# Altium schematic sheet Flash - M25P32-VMW6TG.SchDoc
size A4; minSupply: 2V4; maxSupply: 3V7
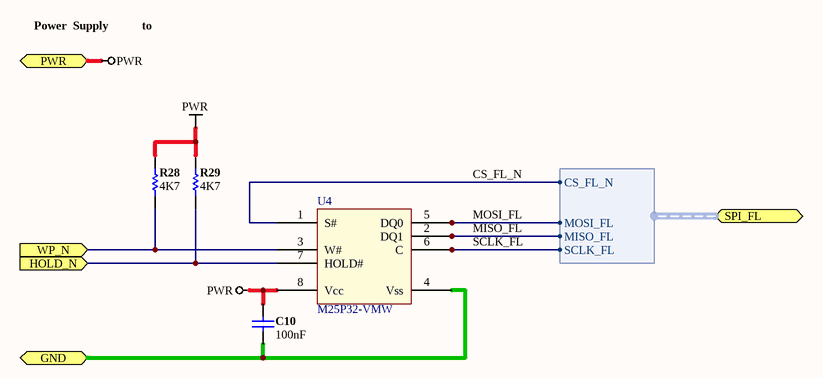
[diagram p0: Flash - M25P32-VMW6TG.SchDoc]

## Parts
C10  value 100nF  [CAPC0402(1005)60_L]  (hidden comment: CAP 100nF 16V 0402(1005))
R28  4K7  [RESC0402(1005)40_L]
R29  4K7  [RESC0402(1005)40_L]
U4  M25P32-VMW  [SOIC-8W]

## Ports
GND, HOLD_N (in), PWR, SPI_FL (harness SPI_FLASH), WP_N (in)

## Harnesses
SPI_FLASH: MOSI_FL, MISO_FL, SCLK_FL, CS_FL_N

## Nets
PWR: C10.1 R28.2 R29.2 U4.8(Vcc) ; port PWR
CS_FL_N: U4.1(S#) ; port SPI_FL.CS_FL_N
GND: C10.2 U4.4(Vss) ; port GND
HOLD_N: R29.1 U4.7(HOLD#) ; port HOLD_N
MISO_FL: U4.2(DQ1) ; port SPI_FL.MISO_FL
MOSI_FL: U4.5(DQ0) ; port SPI_FL.MOSI_FL
SCLK_FL: U4.6(C) ; port SPI_FL.SCLK_FL
WP_N: R28.1 U4.3(W#) ; port WP_N

## Notes on the sheet
- Power  Supply
- to

## Library data of the parts
C10 = CAP 100nF 16V ±10% 0402 (1005 Metric) Thickness 0.6mm SMD: Manufacturer_PN: C0402C104K8PACTU; Case-EIA: 0402; Case-Metric: 1005; Tolerance: ±10%; Max Thickness: 0.6 mm; Rated Voltage: 16 V; Technology: SMT; Manufacturer Part Number: C0402C104K8PACTU
R28 R29 = 0402 (1005 Metric) 1/16 W 4K7 1 Thick Film Chip Resistor: Manufacturer_PN: CR0402-FX-4701GLFDKR-ND; Case-EIA: 0402; Case-Metric: 1005; Temp Coefficient ppm/°C: ±100; Tolerance %: 1%; Value (Ohms): 4700; Power: 1/16 W; Value: 4K7; Technology: SMT; Manufacturer Part Number: CR0402-FX-4701GLFDKR-ND
U4 = M25P32-VMW6TG